# EAGLE schematic ESP32_IMUtracker_revA (EAGLE 9.3.1)

## Sheet 1 of 4
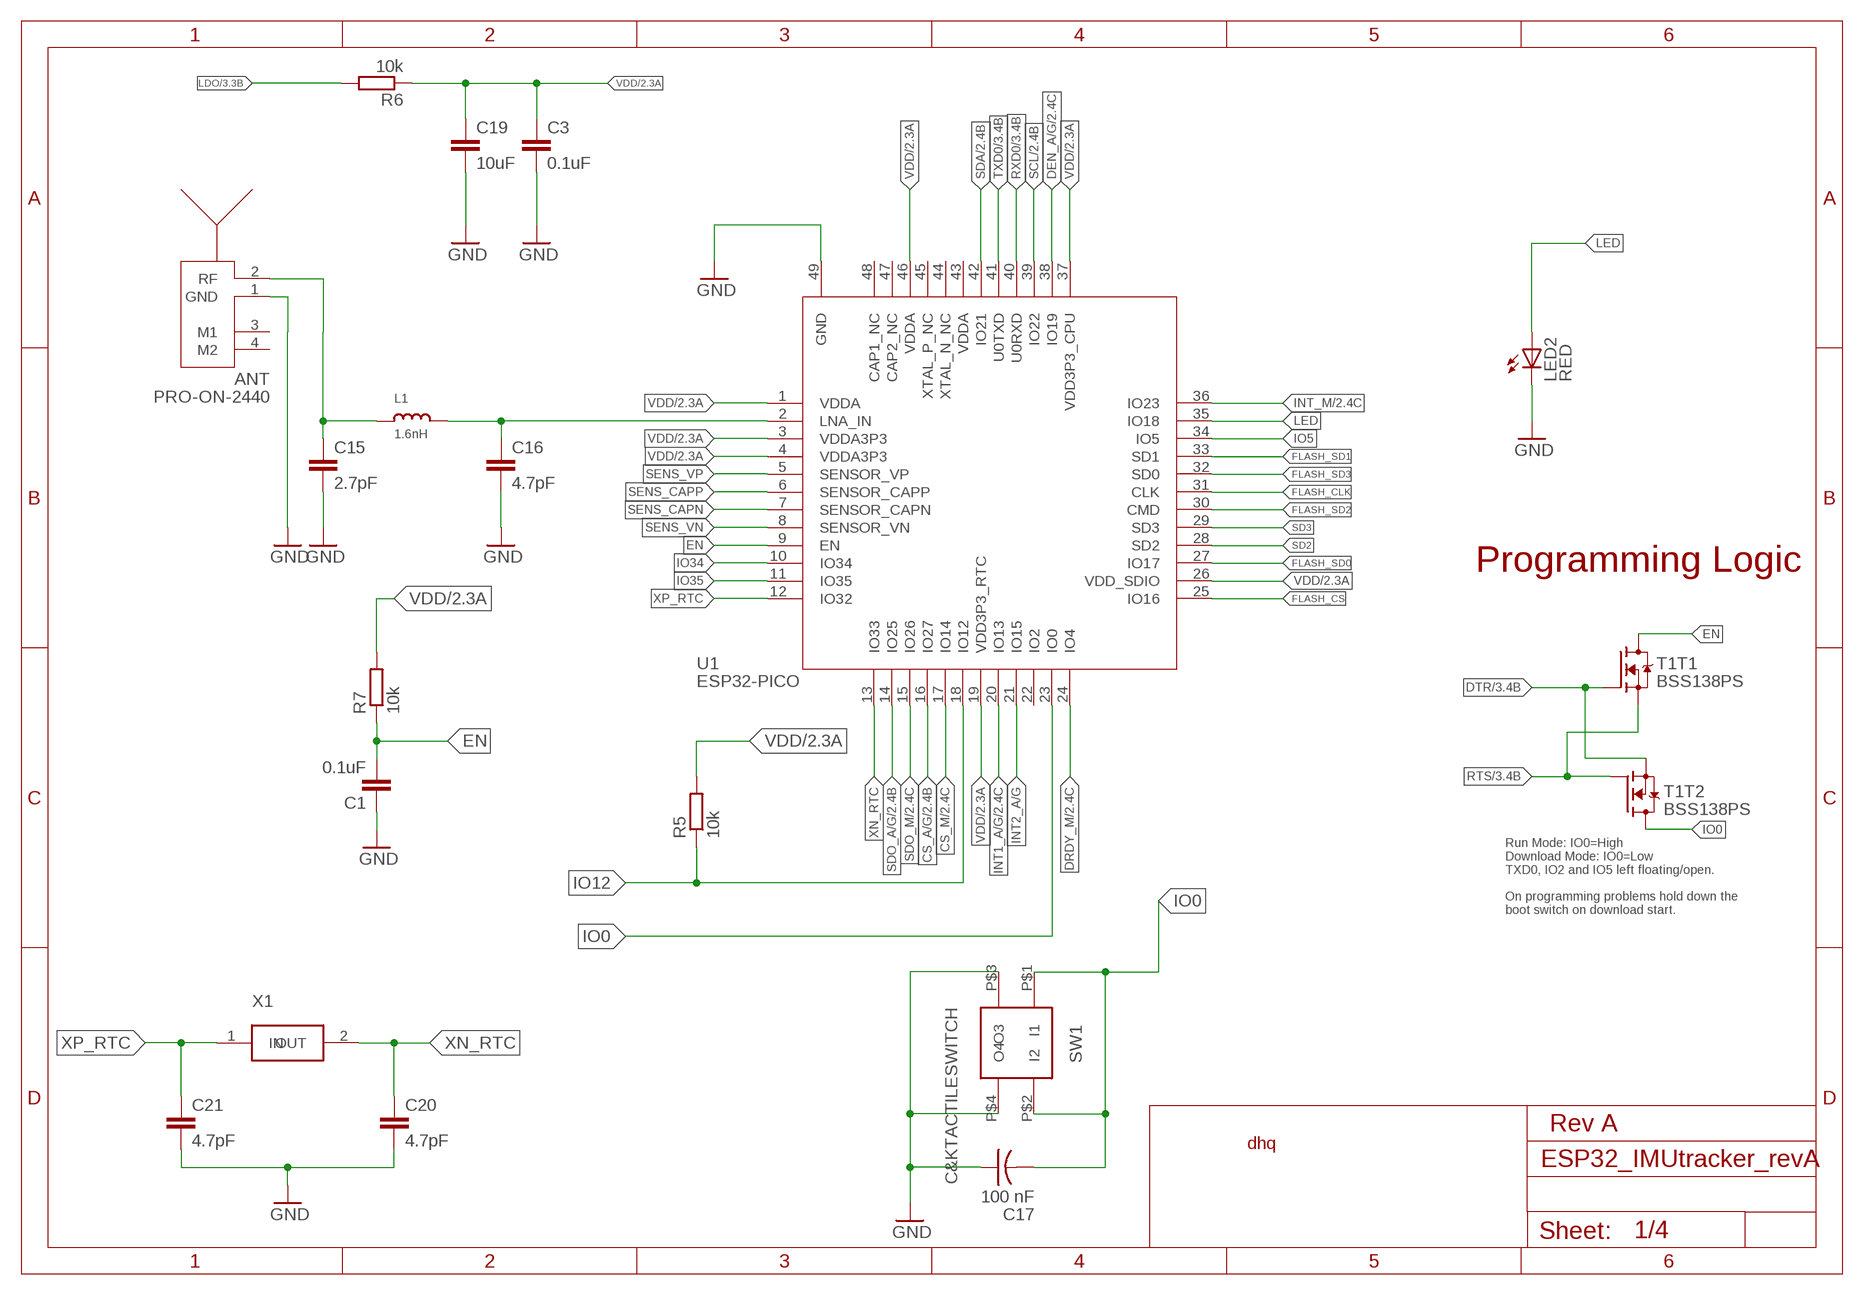
[diagram p0: schematic, sheet 1]

### Parts
ANT  PRO-ON-2440  [ONBOARDSMD]
C1  0.1uF  C-EUC0402  [C0402]
C3  0.1uF  C-EUC0402  [C0402]
C15  2.7pF  C-EUC0402  [C0402]
C16  4.7pF  C-EUC0402  [C0402]
C17  100 nF  C-US  [C0402_B]
C19  10uF  C-EUC0603  [C0603]
C20  4.7pF  C-EUC0402  [C0402]
C21  4.7pF  C-EUC0402  [C0402]
L1  1.6nH  INDUCTOR0603  [0603]
LED2  RED  LEDCHIP-LED0603  [CHIP-LED0603]
R5  10k  R-EU_R0402  [R0402]
R6  10k  R-EU_R0402  [R0402]
R7  10k  R-EU_R0402  [R0402]
SW1  C&KTACTILESWITCH  [C&KTACTILESWITCH]
T1  BSS138PS  [SOT363]
U1  ESP32-PICO  [QFN48]
X1  ST2012SB  [ST2012SB]

### Nets
CS_A/G: U1.16(IO27) ; also sheet 2
CS_M: U1.17(IO14) ; also sheet 2
DEN_A/G: U1.38(IO19) ; also sheet 2
DRDY_M: U1.24(IO4) ; also sheet 2
DTR: T1.2(T1:G) T1.4(T2:S) ; also sheet 3
EN: C1.2 R7.1 T1.6(T1:D) U1.9(EN)
FLASH_CLK: U1.31(CLK)
FLASH_CS: U1.25(IO16)
FLASH_SD0: U1.27(IO17)
FLASH_SD1: U1.33(SD1)
FLASH_SD2: U1.30(CMD)
FLASH_SD3: U1.32(SD0)
GND: ANT.1(GND) C1.1 C3.2 C15.2 C16.2 C17.1 C19.2 C20.2 C21.2 LED2.C SW1.P$3(O3) SW1.P$4(O4) U1.49(GND) ; also sheet 2,3,4
INT1_A/G: U1.20(IO13) ; also sheet 2
INT2_A/G: U1.21(IO15)
INT_M: U1.36(IO23) ; also sheet 2
IO0: C17.2 SW1.P$1(I1) SW1.P$2(I2) T1.3(T2:D) U1.23(IO0)
IO5: U1.34(IO5)
IO12: R5.1 U1.18(IO12)
IO34: U1.10(IO34)
IO35: U1.11(IO35)
LDO: R6.2 ; also sheet 3,4
LED: LED2.A U1.35(IO18)
N$11: C16.1 L1.2 U1.2(LNA_IN)
RF_FEED: ANT.2(RF) C15.1 L1.1
RTS: T1.1(T1:S) T1.5(T2:G) ; also sheet 3
RXD0: U1.40(U0RXD) ; also sheet 3
SCL: U1.39(IO22) ; also sheet 2
SD2: U1.28(SD2)
SD3: U1.29(SD3)
SDA: U1.42(IO21) ; also sheet 2
SDO_A/G: U1.14(IO25) ; also sheet 2
SDO_M: U1.15(IO26) ; also sheet 2
SENS_CAPN: U1.7(SENSOR_CAPN)
SENS_CAPP: U1.6(SENSOR_CAPP)
SENS_VN: U1.8(SENSOR_VN)
SENS_VP: U1.5(SENSOR_VP)
TXD0: U1.41(U0TXD) ; also sheet 3
VDD: C3.1 C19.1 R5.2 R6.1 R7.2 U1.1(VDDA) U1.3(VDDA3P3) U1.4(VDDA3P3) U1.19(VDD3P3_RTC) U1.26(VDD_SDIO) U1.37(VDD3P3_CPU) U1.46(VDDA) ; also sheet 2
XN_RTC: C20.1 U1.13(IO33) X1.2(OUT)
XP_RTC: C21.1 U1.12(IO32) X1.1(IN)
Unconnected: ANT.3(M1) ANT.4(M2) U1.22(IO2) U1.43(VDDA) U1.44(XTAL_N_NC) U1.45(XTAL_P_NC) U1.47(CAP2_NC) U1.48(CAP1_NC)

### Notes on the sheet
- Programming Logic
- Run Mode: IO0=High
  Download Mode: IO0=Low
  TXD0, IO2 and IO5 left floating/open.
  
  On programming problems hold down the 
  boot switch on download start.
- Rev A
- dhq

## Sheet 2 of 4
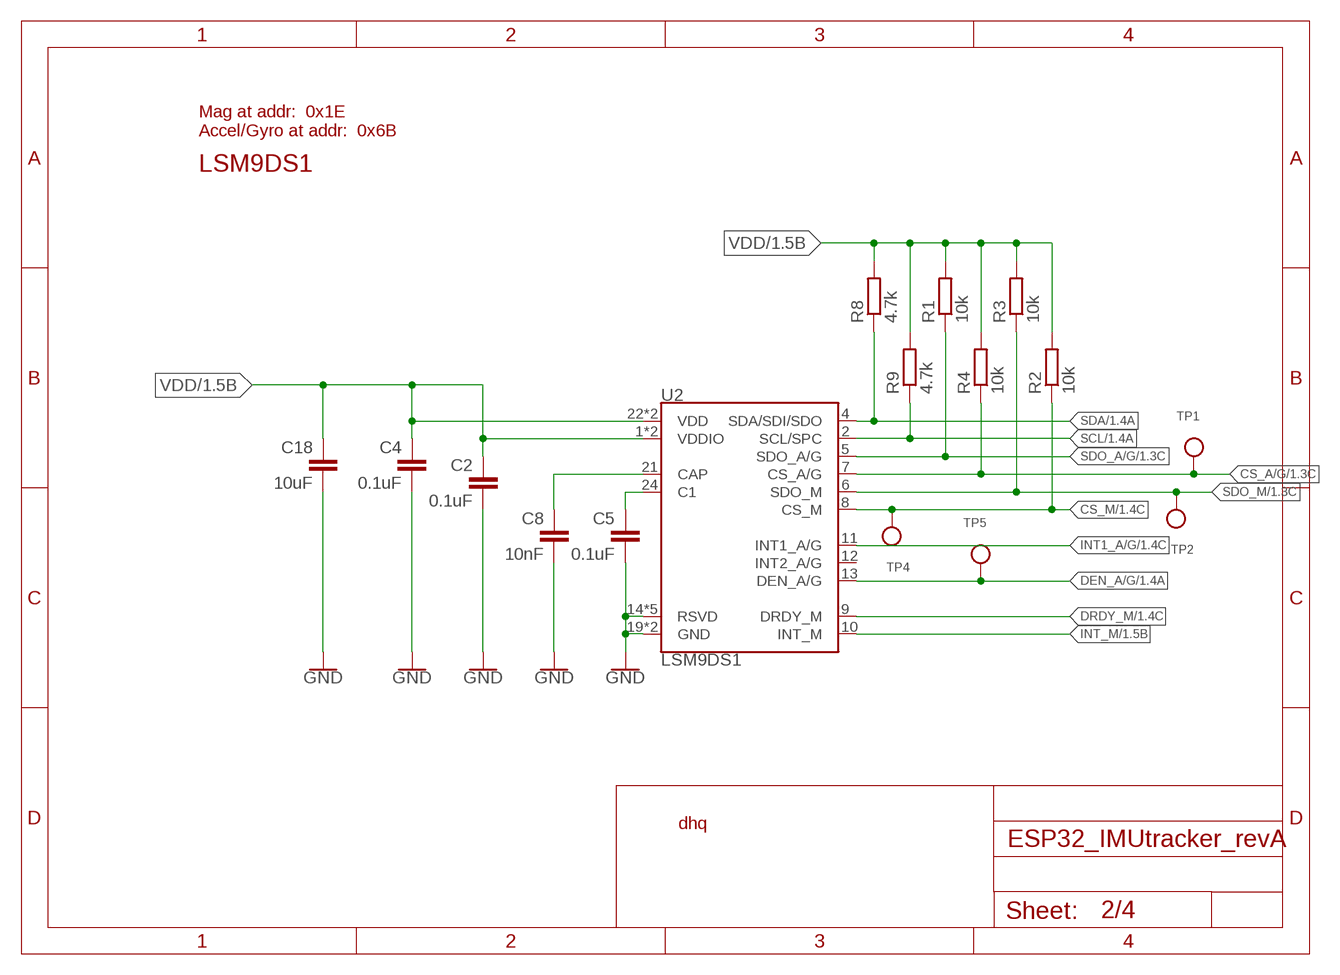
[diagram p1: schematic, sheet 2]

### Parts
C2  0.1uF  0.1UF-0402-16V-10%  [0402]
C4  0.1uF  0.1UF-0402-16V-10%  [0402]
C5  0.1uF  0.1UF-0402-16V-10%  [0402]
C8  10nF  C-EUC0402  [C0402]
C18  10uF  10UF-0603-6.3V-20%  [0603]
R1  10k  R-EU_R0402  [R0402]
R2  10k  R-EU_R0402  [R0402]
R3  10k  R-EU_R0402  [R0402]
R4  10k  R-EU_R0402  [R0402]
R8  4.7k  R-EU_R0402  [R0402]
R9  4.7k  R-EU_R0402  [R0402]
TP1  TESTPOINTROUND0.5MM  [TESTPOINT_ROUND_0.5MM]
TP2  TESTPOINTROUND0.5MM  [TESTPOINT_ROUND_0.5MM]
TP4  TESTPOINTROUND0.5MM  [TESTPOINT_ROUND_0.5MM]
TP5  TESTPOINTROUND0.5MM  [TESTPOINT_ROUND_0.5MM]
U2  LSM9DS1  [LGA-24-3.5X3]

### Nets
C2: C5.1 U2.24(C1)
CAP1: C8.1 U2.21(CAP)
CS_A/G: R4.1 TP1.P$1 U2.7(CS_A/G) ; also sheet 1
CS_M: R2.1 TP4.P$1 U2.8(CS_M) ; also sheet 1
DEN_A/G: TP5.P$1 U2.13(DEN_A/G) ; also sheet 1
DRDY_M: U2.9(DRDY_M) ; also sheet 1
GND: C2.2 C4.2 C5.2 C8.2 C18.2 U2.14(RSVD) U2.15(RSVD) U2.16(RSVD) U2.17(RSVD) U2.18(RSVD) U2.19(GND) U2.20(GND) ; also sheet 1,3,4
INT1_A/G: U2.11(INT1_A/G) ; also sheet 1
INT_M: U2.10(INT_M) ; also sheet 1
SCL: R9.1 U2.2(SCL/SPC) ; also sheet 1
SDA: R8.1 U2.4(SDA/SDI/SDO) ; also sheet 1
SDO_A/G: R1.1 U2.5(SDO_A/G) ; also sheet 1
SDO_M: R3.1 TP2.P$1 U2.6(SDO_M) ; also sheet 1
VDD: C2.1 C4.1 C18.1 R1.2 R2.2 R3.2 R4.2 R8.2 R9.2 U2.1(VDDIO) U2.3(VDDIO) U2.22(VDD) U2.23(VDD) ; also sheet 1
Unconnected: U2.12(INT2_A/G)

### Notes on the sheet
- Mag at addr:  0x1E
  Accel/Gyro at addr:  0x6B
- LSM9DS1
- dhq

## Sheet 3 of 4
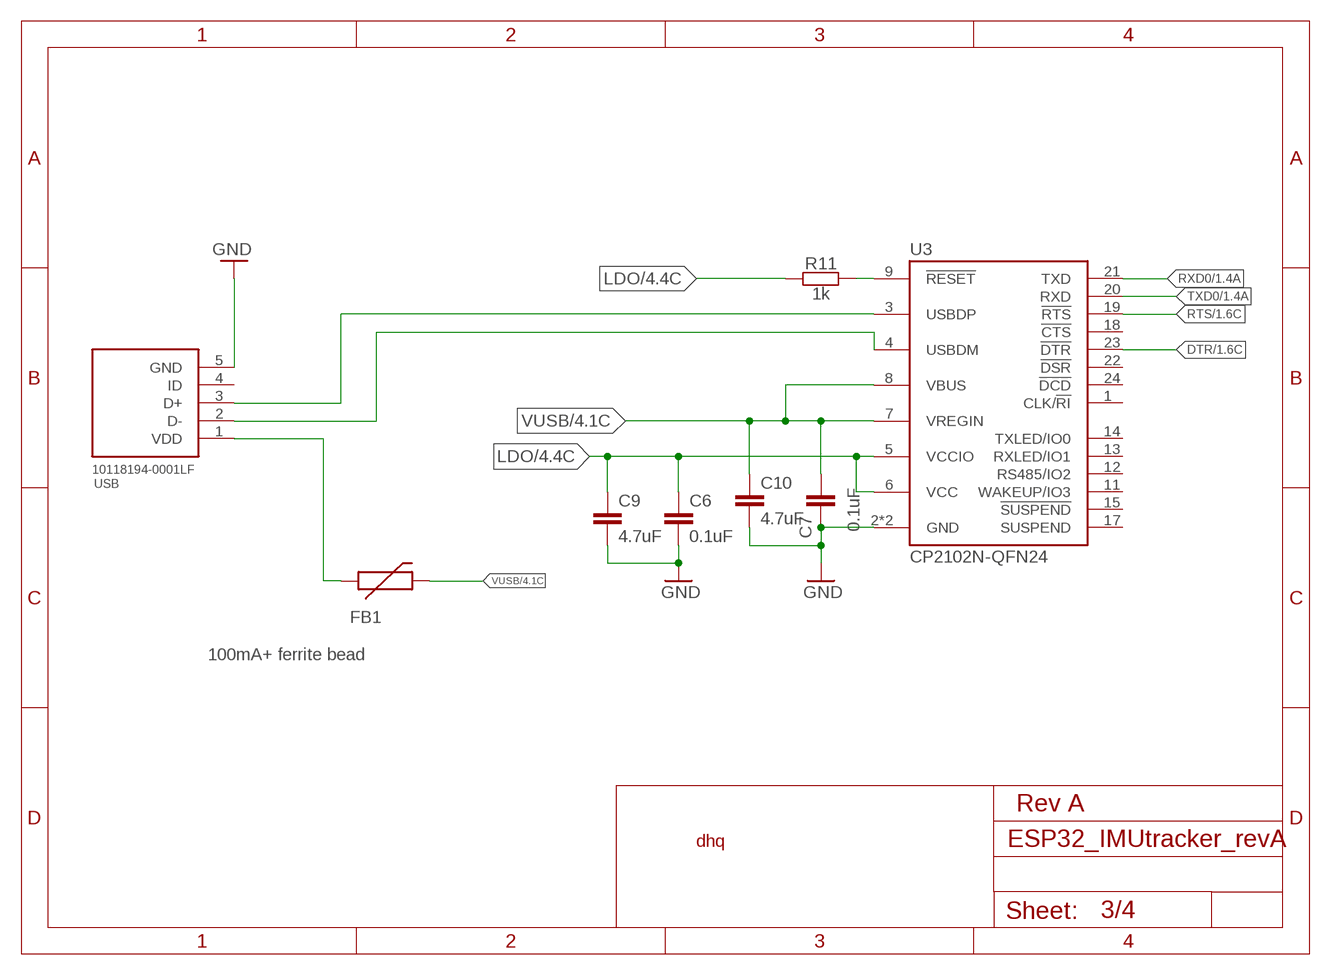
[diagram p2: schematic, sheet 3]

### Parts
C6  0.1uF  C-EUC0402  [C0402]
C7  0.1uF  C-EUC0402  [C0402]
C9  4.7uF  C-EUC0603  [C0603]
C10  4.7uF  C-EUC0603  [C0603]
FB1  100mA+ ferrite bead  PTC0603  [0603]
R11  1k  RESISTOR-0402  [C0402]
U3  CP2102N-QFN24  [QFN24-PAD]
USB  10118194-0001LF  [FRAMATOME_10118194-0001LF]

### Nets
D_NEG: U3.4(USBDM) USB.2(D-)
D_POS: U3.3(USBDP) USB.3(D+)
DTR: U3.23(!DTR) ; also sheet 1
GND: C6.2 C7.1 C9.2 C10.2 U3.2(GND) U3.TP(GND) USB.5(GND) ; also sheet 1,2,4
LDO: C6.1 C9.1 R11.1 U3.5(VCCIO) U3.6(VCC) ; also sheet 1,4
N$5: FB1.1 USB.1(VDD)
RESET: R11.2 U3.9(!RESET)
RTS: U3.19(!RTS) ; also sheet 1
RXD0: U3.21(TXD) ; also sheet 1
TXD0: U3.20(RXD) ; also sheet 1
VUSB: C7.2 C10.1 FB1.2 U3.7(VREGIN) U3.8(VBUS) ; also sheet 4
Unconnected: U3.1(CLK/!RI) U3.11(WAKEUP/IO3) U3.12(RS485/IO2) U3.13(RXLED/IO1) U3.14(TXLED/IO0) U3.15(!SUSPEND) U3.17(SUSPEND) U3.18(!CTS) U3.22(!DSR) U3.24(!DCD) USB.4(ID)

### Notes on the sheet
- Rev A
- dhq

## Sheet 4 of 4
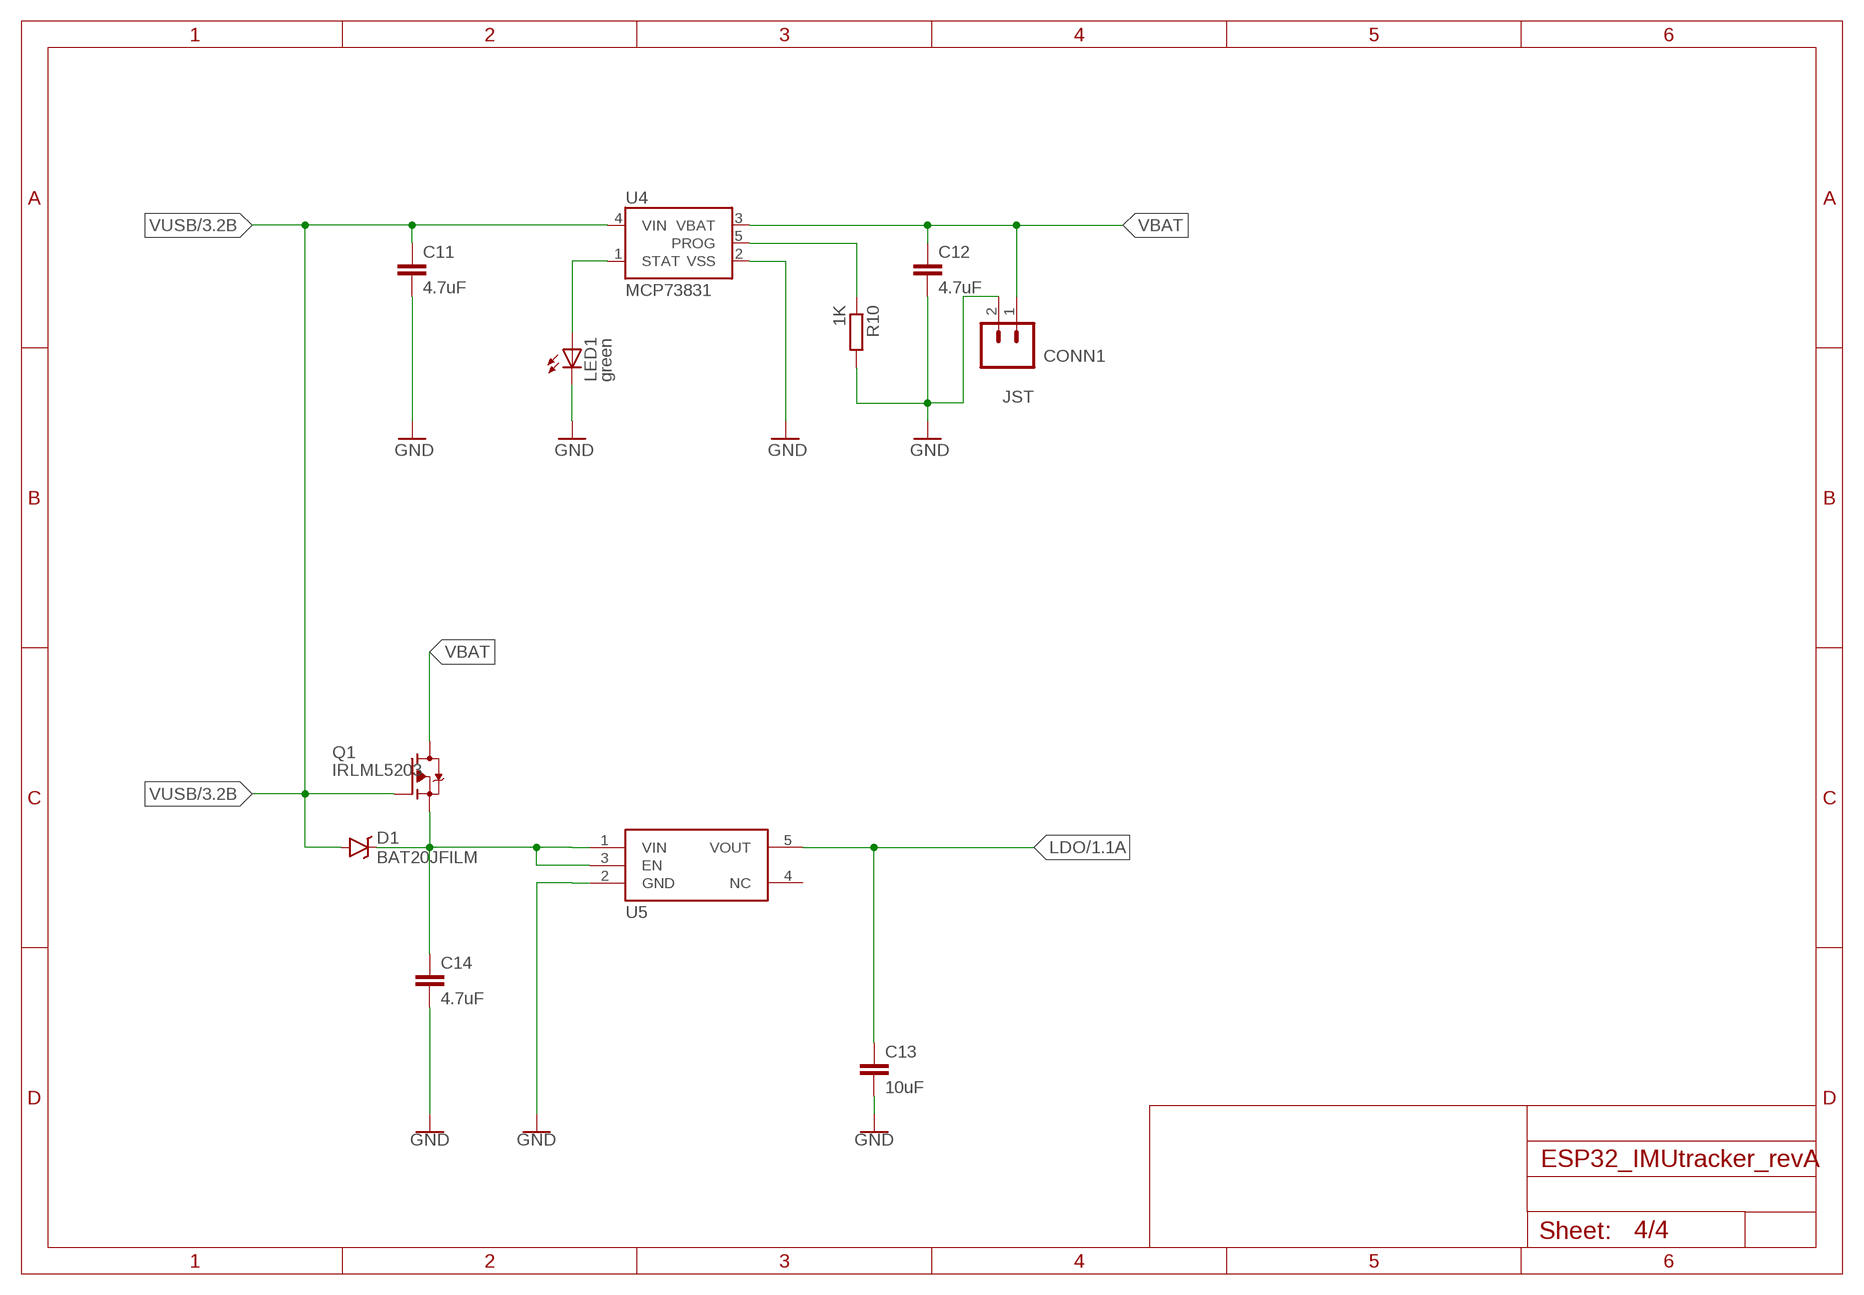
[diagram p3: schematic, sheet 4]

### Parts
C11  4.7uF  C-EUC0603  [C0603]
C12  4.7uF  C-EUC0603  [C0603]
C13  10uF  C-EUC0603  [C0603]
C14  4.7uF  C-EUC0603  [C0603]
CONN1  JST  SPARKFUN-CONNECTORS_M02-JST-2MM-SMT  [SPARKFUN-CONNECTORS_JST-2-SMD]
D1  BAT20JFILM  [SOD-323]
LED1  green  LED-0603  [C0603]
Q1  IRLML5203  TRANSISTOR_FET_TSM2301CX  [SOT-23]
R10  1K  R-EU_R0402  [R0402]
U4  MCP73831  [SOT23-5]
U5  AP2112  [SOT95P280X145-5N]

### Nets
GND: C11.2 C12.2 C13.2 C14.2 CONN1.2 LED1.C R10.2 U4.2(VSS) U5.2(GND) ; also sheet 1,2,3
LDO: C13.1 U5.5(VOUT) ; also sheet 1,3
N$2: R10.1 U4.5(PROG)
N$7: C14.1 D1.C Q1.2(S) U5.1(VIN) U5.3(EN)
PWR-LED1: LED1.A U4.1(STAT)
VBAT: C12.1 CONN1.1 Q1.3(D) U4.3(VBAT)
VUSB: C11.1 D1.A Q1.1(G) U4.4(VIN) ; also sheet 3
Unconnected: U5.4(NC)

## Library data of the parts
ANT = PRO-OB-440:PRO-ON-2440: OnBoard™ SMD 2400 Antenna; SPICEPREFIX: E
C1 C3 C6-C10 C13-C16 C19-C21 = rcl:C-EU: CAPACITOR, European symbol; SPICEPREFIX: C
C2 C4 C5 = SparkFun-Capacitors:0.1UF: 0.1µF ceramic capacitors A capacitor is a passive two-terminal electrical component used to store electrical energy temporarily in an electric field.; PROD_ID: CAP-12416
C11 C12 = rcl:C-EU: CAPACITOR, European symbol
C17 = Spark:C-US: Capacitor
C18 = SparkFun-Capacitors:10UF: 10.0µF ceramic capacitors A capacitor is a passive two-terminal electrical component used to store electrical energy temporarily in an electric field.; PROD_ID: CAP-11015
CONN1 = CarTracker:SPARKFUN-CONNECTORS_M02: Standard 2-pin 0.1" header. Use with - straight break away headers ( PRT-00116) - right angle break away headers (PRT-00553) - swiss pins (PRT-00743) - machine pins (PRT-00117) - female headers (PRT-00115) Molex polarized connector foot print use with: PRT-08233 with associated crimp pins and housings. 2.54_SCREWTERM for use with PRT-10571. 3.5mm Screw Terminal footprints for PRT-08084 5mm Screw Terminal footprints for use with PRT-08432; PROD_ID: CONN-11443
D1 = BAT20JFILM:BAT20JFILM: 23V, 1A Schottky diode, SOD-323 package; AVAILABILITY: Good; DESCRIPTION: BAT20 Series Switching 1 A 0.62 V Schottky Diode Surface Mount - SOD-323; MF: STMicroelectronics; MP: BAT20JFILM; PACKAGE: SOD-323 STMicroelectronics; PRICE: 0.13 USD
FB1 = SparkFun-PowerIC:PTC: Resettable Fuse PTC Resettable Fuse. Spark Fun Electronics SKU : COM-08357
L1 = microbuilder:INDUCTOR: Inductors 0603: 10nH Ceramic Inductor - microwire antenna/RF (Digikey: 712-1434-2-ND) 0805: 560nH Ceramic Inductor - RF (Digikey: 553-1047-1-ND) 270nH Ceramic Inductor - Q = 40@250MHz, +-5%, 1 Ohm DC Resistance (Digikey: 535-10506-2-ND) 1007 (2518 Metric) SMT: 10µH 10% 250mOhm 820mA 1007 Inductor (Digikey: 587-2189-1-ND) 22µH 10% 500mOhm 580mA 1007 Inductor (Digikey: 587-2190-1-ND) 47µH 10% 950mOhm 420mA 1007 Inductor (Digikey: 587-2191-1-ND) 47µH 5% 100mOhm 1A 1008 Inductor (Digikey: 732-1816-1-ND) 5.0x5.0mm (Taiyo Yuden NR5040 Series) 6.8µH 20% 2.3A 64mOhm Inductor (Digikey: 587-2374-2-ND) 5.0x5.0mm (TDK VLC5045 Series) 4.7µH 20% 3.3A 34mOhm Inductor (Digikey: 445-6526-1-ND) 6.8µH 20% 2.7A 46mOhm Inductor (Digikey: 445-6527-1-ND) 6.0x6.0mm (TDK VLC6045 Series) 4.7µH 20% 3.8A 27mOhm Inductor (Digikey: 445-6538-2-ND) 6.8µH 20% 3A 41mOhm Inductor (Digikey: 445-6540-1-ND) 6.2µH 30% 2.2A 45mOhm Inductor (Digikey: SRR5028-6R2YCT-ND) - Not TDK VLC6045 but footprint should match 6.0x6.0mm (TDK SLF6045 Series) 6.8uH 30% 2A 33mOhm Inductor (Digikey: 445-4572-1-ND, Mouser: 810-SLF645T6R8N2R0PF)
LED1 = we-opto:LED: LEDs red, green, blue -> 0603
LED2 = adafruit:LED: LED OSRAM: - CHIPLED LG R971, LG N971, LY N971, LG Q971, LY Q971, LO R971, LY R971 LH N974, LH R974 LS Q976, LO Q976, LY Q976 LO Q996 - Hyper CHIPLED LW Q18S LB Q993, LB Q99A, LB R99A - SideLED LS A670, LO A670, LY A670, LG A670, LP A670 LB A673, LV A673, LT A673, LW A673 LH A674 LY A675 LS A676, LA A676, LO A676, LY A676, LW A676 LS A679, LY A679, LG A679 - Hyper Micro SIDELED® LS Y876, LA Y876, LO Y876, LY Y876 LT Y87S - SmartLED LW L88C, LW L88S LB L89C, LB L89S, LG L890 LS L89K, LO L89K, LY L89K LS L896, LA L896, LO L896, LY L896 - TOPLED LS T670, LO T670, LY T670, LG T670, LP T670 LSG T670, LSP T670, LSY T670, LOP T670, LYG T670 LG T671, LOG T671, LSG T671 LB T673, LV T673, LT T673, LW T673 LH T674 LS T676, LA T676, LO T676, LY T676, LB T676, LH T676, LSB T676, LW T676 LB T67C, LV T67C, LT T67C, LS T67K, LO T67K, LY T67K, LW E67C LS E67B, LA E67B, LO E67B, LY E67B, LB E67C, LV E67C, LT E67C LW T67C LS T679, LY T679, LG T679 LS T770, LO T770, LY T770, LG T770, LP T770 LB T773, LV T773, LT T773, LW T773 LH T774 LS E675, LA E675, LY E675, LS T675 LS T776, LA T776, LO T776, LY T776, LB T776 LHGB T686 LT T68C, LB T68C - Hyper Mini TOPLED® LB M676 - Mini TOPLED Santana® LG M470 LS M47K, LO M47K, LY M47K Source: http://www.osram.convergy.de/
Q1 = dp_devices:TRANSISTOR_FET_TSM2301CX: 20V P-Channel Enhancement Mode MOSFET
R1-R10 = rcl:R-EU_: RESISTOR, European symbol; SPICEPREFIX: R
R11 = we-rcl:RESISTOR: Resistors all kinds in 0402 and 0603
SW1 = Kris:C&KTACTILESWITCH: C&K Tactile Switch 611-PTS810SJS250SMTR
T1 = we-transistor:BSS138PS: Dual N-Channel MOSFET BSS138 (Vgs>=+/-20V, Vds>=40V, Id>=0.2A + Rds<=3Ohm @ Vgs=4.5V)
TP1 TP2 TP4 TP5 = microbuilder:TESTPOINT: Test Point Various test points for characterisation and PCB testing TESTPOINT_SMT - Compact Surface Mount Test Point [Digikey: 5016KTR-ND]
U1 = ESP32-PICO:ESP32-PICO: ESP32-PICO-D4
U2 = SparkFun-Sensors:LSM9DS1: ST Microelectronics LSM9DS1 9DOF IMU - Accelerometer, Gyroscope & Magnetometer The LSM9DS1 is a versatile, motion-sensing system-in-a-chip. It houses a 3-axis accelerometer, 3-axis gyroscope, and 3-axis magnetometer – nine degrees of freedom (9DOF) in a single IC! The LSM9DS1 is equipped with a digital interface, but even that is flexible: it supports both I2C and SPI, so you’ll be hard-pressed to find a microcontroller it doesn’t work with. Datasheet <https://cdn.sparkfun.com/assets/learn_tutorials/3/7/3/LSM9DS1_Datasheet.pdf> SparkFun Products SparkFun 9 Degrees of Freedom IMU Breakout - LSM9DS1 <https://www.sparkfun.com/products/13284> (SEN-13284) SparkFun Photon IMU Shield <https://www.sparkfun.com/products/13629> (DEV-13629); PROD_ID: IC-12536
U3 = we-chip:CP2102N: Silabs CP2102N USB to UART Bridge (5V tolerant inputs) CP2102N-QFN24 is pin-compatible with CP2104.
U4 = SparkFun-PowerIC:MCP73831: Miniature single cell, fully integrated Li-Ion, Li-polymer charge management controller http://ww1.microchip.com/downloads/en/DeviceDoc/20001984g.pdf IC-09995; PROD_ID: IC-09995
U5 = AP2112:AP2112: 600 mA CMOS LDO with ENABLE
USB = 10118194-0001LF2:10118194-0001LF: Conn Micro USB Type B RCP 5 POS 0.65mm Solder RA SMD 5 Terminal 1 Port T/R
X1 = Crustal:ST2012SB: Kyocera 2.0 x 1.2 mm 32.768 20kHz ppm 4 pf crystal